# EAGLE design schema (EAGLE 6.3)
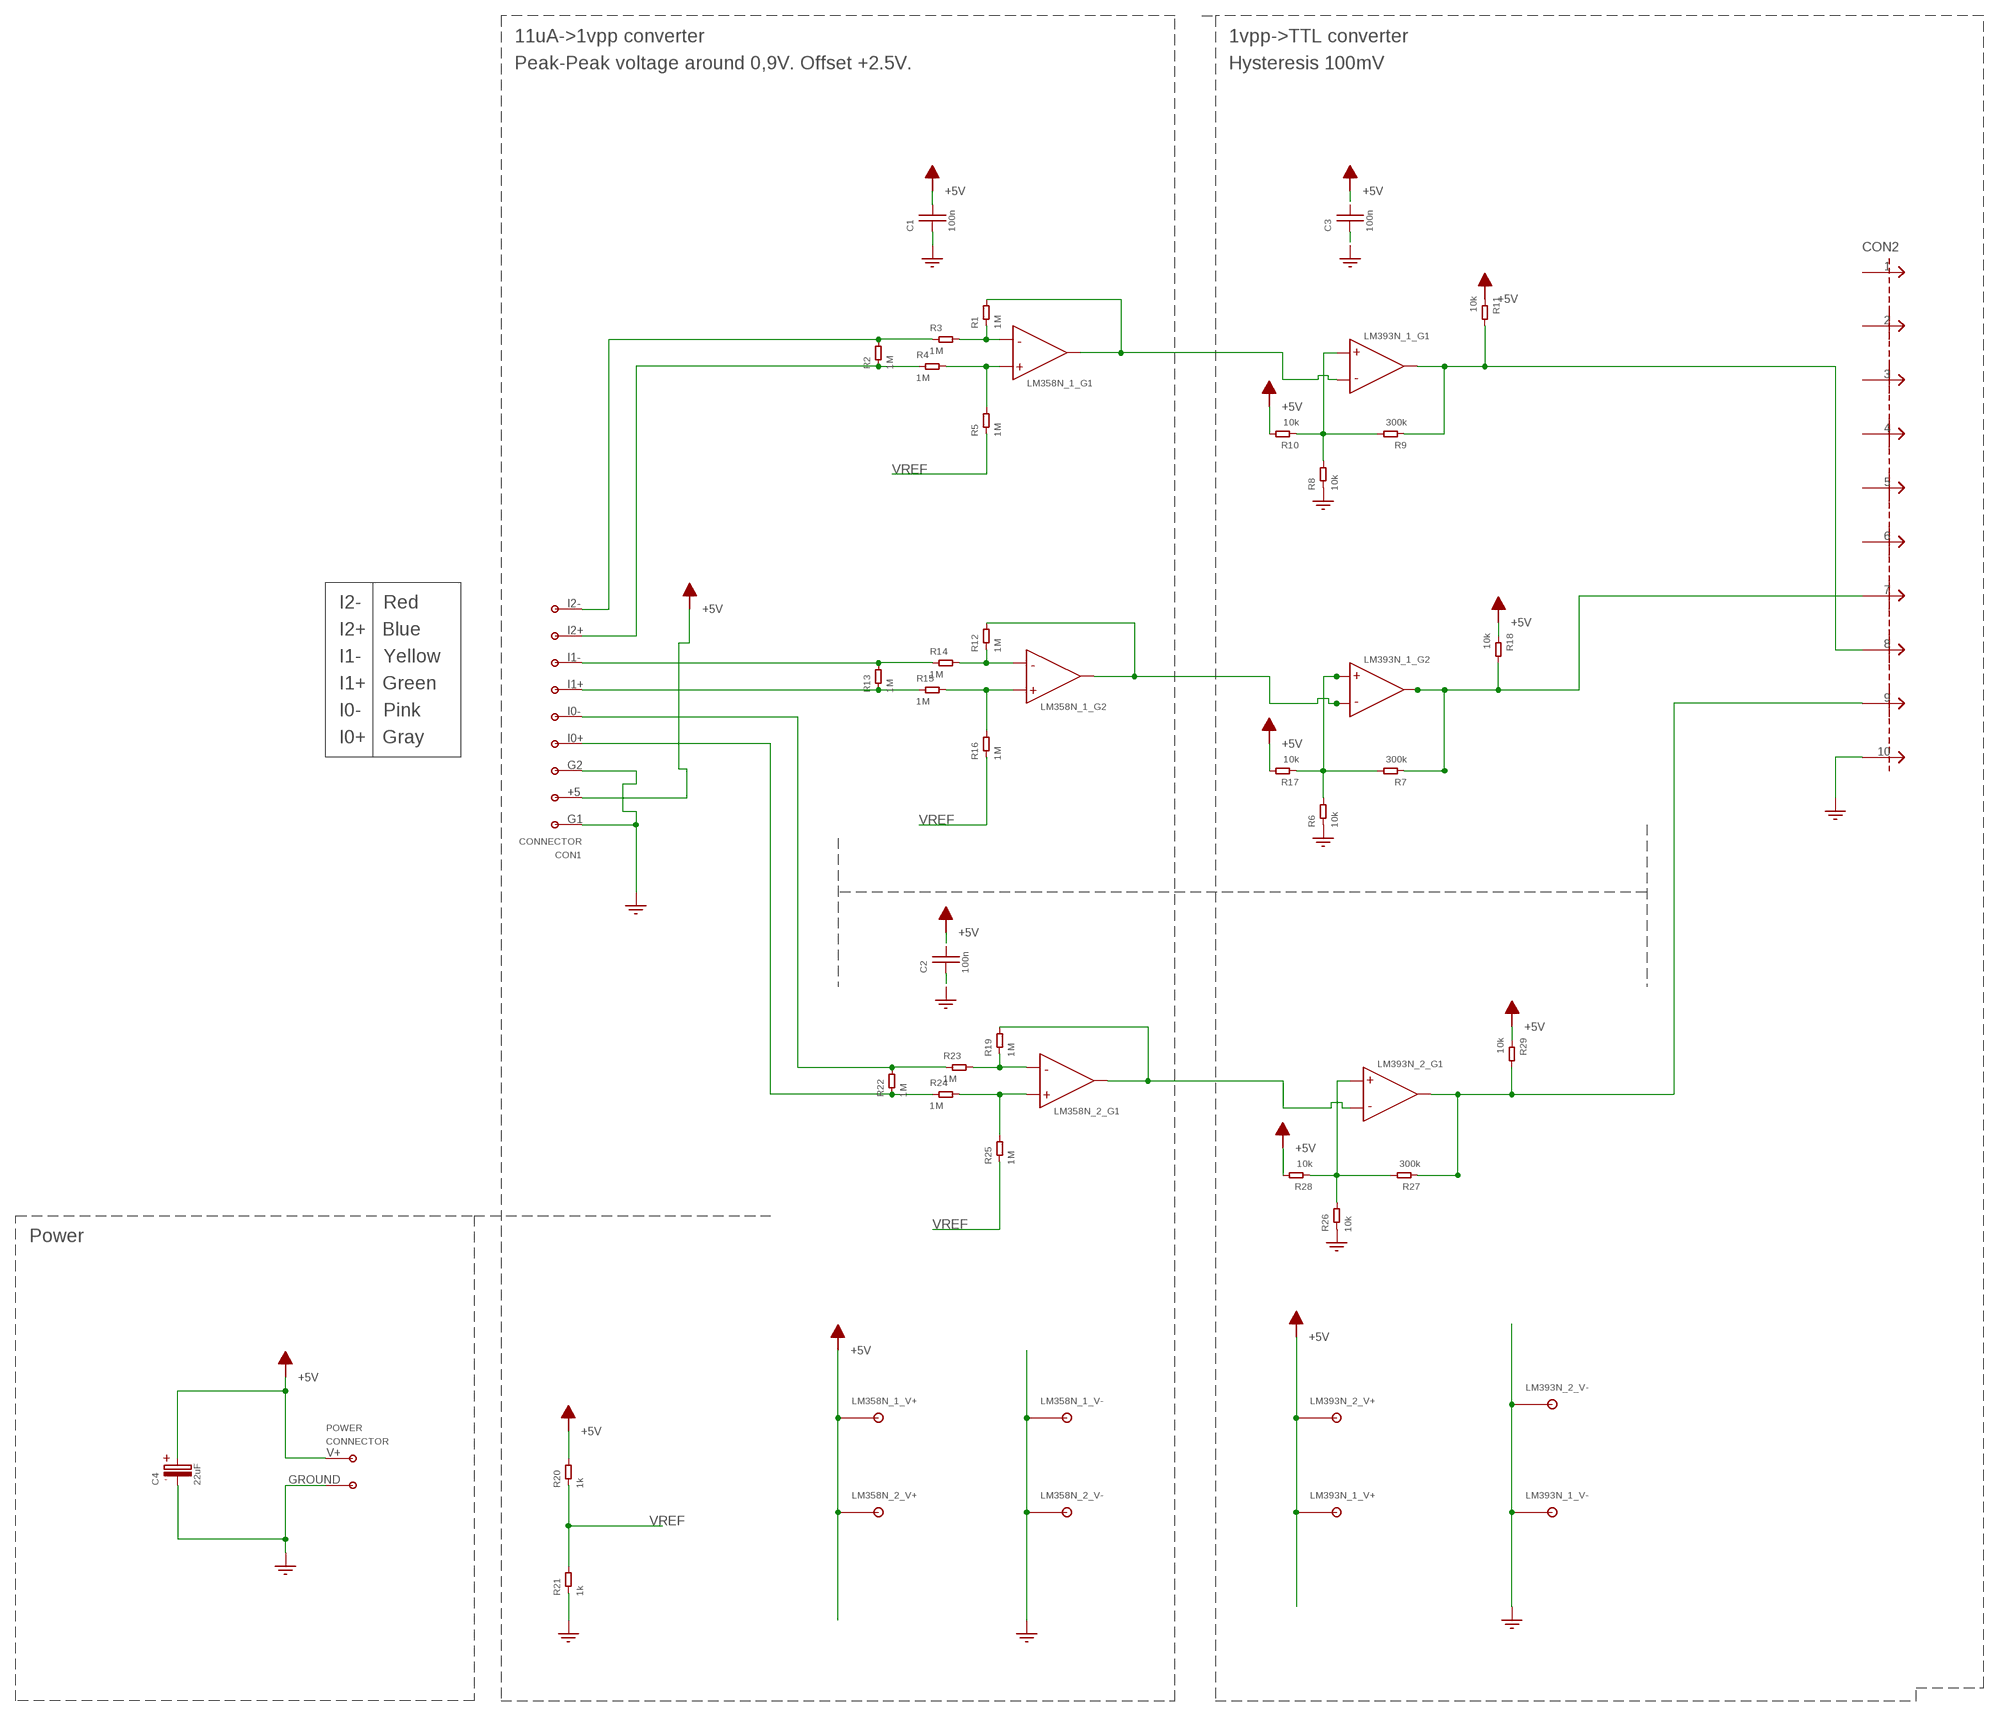
[diagram p0: schematic, sheet 1]

## Parts
C1  100n  CC1206  [R0805]
C2  100n  CC1206  [R0805]
C3  100n  CC1206  [R0805]
C4  22uF  C_POL  [E2,5-6]
CON1  LS403_INPUT_CONNECTOR  [LS403_INPUT_CONNECTOR]
CON2  CONNECTOR_10PINGENERIC2X5  [2X5_GENERIC]
LM358N_1  LM358DIL8  [DIL08]
LM358N_2  LM358DIL8  [DIL08]
LM393N_1  LM393N  [DIL08]
LM393N_2  LM393N  [DIL08]
POWER  2_PIN_CONNECTOR  [2_PIN_GENERIC_POWER_CONNECTOR]
R1  1M  RR0805  [R0805]
R2  1M  RR0805  [R0805]
R3  1M  RR0805  [R0805]
R4  1M  RR0805  [R0805]
R5  1M  RR0805  [R0805]
R6  10k  RR0805  [R0805]
R7  300k  RR0805  [R0805]
R8  10k  RR0805  [R0805]
R9  300k  RR0805  [R0805]
R10  10k  RR0805  [R0805]
R11  10k  RR0805  [R0805]
R12  1M  RR0805  [R0805]
R13  1M  RR0805  [R0805]
R14  1M  RR0805  [R0805]
R15  1M  RR0805  [R0805]
R16  1M  RR0805  [R0805]
R17  10k  RR0805  [R0805]
R18  10k  RR0805  [R0805]
R19  1M  RR0805  [R0805]
R20  1k  RR0805  [R0805]
R21  1k  RR0805  [R0805]
R22  1M  RR0805  [R0805]
R23  1M  RR0805  [R0805]
R24  1M  RR0805  [R0805]
R25  1M  RR0805  [R0805]
R26  10k  RR0805  [R0805]
R27  300k  RR0805  [R0805]
R28  10k  RR0805  [R0805]
R29  10k  RR0805  [R0805]

## Nets
+5V: C1.1 C2.1 C3.1 C4.+ CON1.+5 LM358N_1.8(_V+:SUPPLYPIN) LM358N_2.8(_V+:SUPPLYPIN) LM393N_1.8(_V+:SUPPLYPIN) LM393N_2.8(_V+:SUPPLYPIN) POWER.V+ R10.2 R11.1 R17.2 R18.1 R20.2 R28.2 R29.1
GND: C1.2 C2.2 C3.2 C4.- CON1.G1 CON1.G2 CON2.10 LM358N_1.4(_V-:SUPPLYPIN) LM358N_2.4(_V-:SUPPLYPIN) LM393N_1.4(_V-:SUPPLYPIN) LM393N_2.4(_V-:SUPPLYPIN) POWER.GROUND R6.1 R8.1 R21.1 R26.1
I0_OUT: CON2.9 LM393N_2.1(_G1:OUT) R27.1 R29.2
I1_OUT: CON2.7 LM393N_1.7(_G2:OUT) R7.1 R18.2
I2_OUT: CON2.8 LM393N_1.1(_G1:OUT) R9.1 R11.2
N$1: LM393N_1.5(_G2:+) R6.2 R7.2 R17.1
N$2: LM358N_1.2(_G1:-) R1.1 R3.2
N$3: LM358N_1.1(_G1:OUT) LM393N_1.2(_G1:-) R1.2
N$4: CON1.I2- R2.2 R3.1
N$5: CON1.I2+ R2.1 R4.1
N$6: LM358N_1.3(_G1:+) R4.2 R5.2
N$7: LM393N_1.3(_G1:+) R8.2 R9.2 R10.1
N$8: LM358N_1.6(_G2:-) R12.1 R14.2
N$10: LM358N_1.7(_G2:OUT) LM393N_1.6(_G2:-) R12.2
N$11: CON1.I1- R13.2 R14.1
N$12: CON1.I1+ R13.1 R15.1
N$13: LM358N_1.5(_G2:+) R15.2 R16.2
N$14: LM358N_2.2(_G1:-) R19.1 R23.2
N$15: LM358N_2.1(_G1:OUT) LM393N_2.2(_G1:-) R19.2
N$17: CON1.I0- R22.2 R23.1
N$18: CON1.I0+ R22.1 R24.1
N$19: LM358N_2.3(_G1:+) R24.2 R25.2
N$20: LM393N_2.3(_G1:+) R26.2 R27.2 R28.1
VREF: R5.1 R16.1 R20.1 R21.2 R25.1
Unconnected: CON2.1 CON2.2 CON2.3 CON2.4 CON2.5 CON2.6 LM358N_2.5(_G2:+) LM358N_2.6(_G2:-) LM358N_2.7(_G2:OUT) LM393N_2.5(_G2:+) LM393N_2.6(_G2:-) LM393N_2.7(_G2:OUT)

## Notes on the sheet
- 11uA->1vpp converter | 1vpp->TTL converter
- Peak-Peak voltage around 0,9V. Offset +2.5V. | Hysteresis 100mV
- I2-    Red
- I2+   Blue
- I1-    Yellow
- I1+   Green
- I0-    Pink
- I0+   Gray
- Power

## Library data of the parts
C1-C3 = library:C
C4 = library:C_POL
CON1 = library:LS403_INPUT_CONNECTOR
CON2 = connectors:CONNECTOR_10PIN; PIN10: GND; PIN7: QA; PIN8: QB; PIN9: QIDX
LM358N_1 LM358N_2 = library:LM358
LM393N_1 LM393N_2 = library:LM393N
POWER = library:2_PIN_CONNECTOR
R1-R29 = library:R

## Board
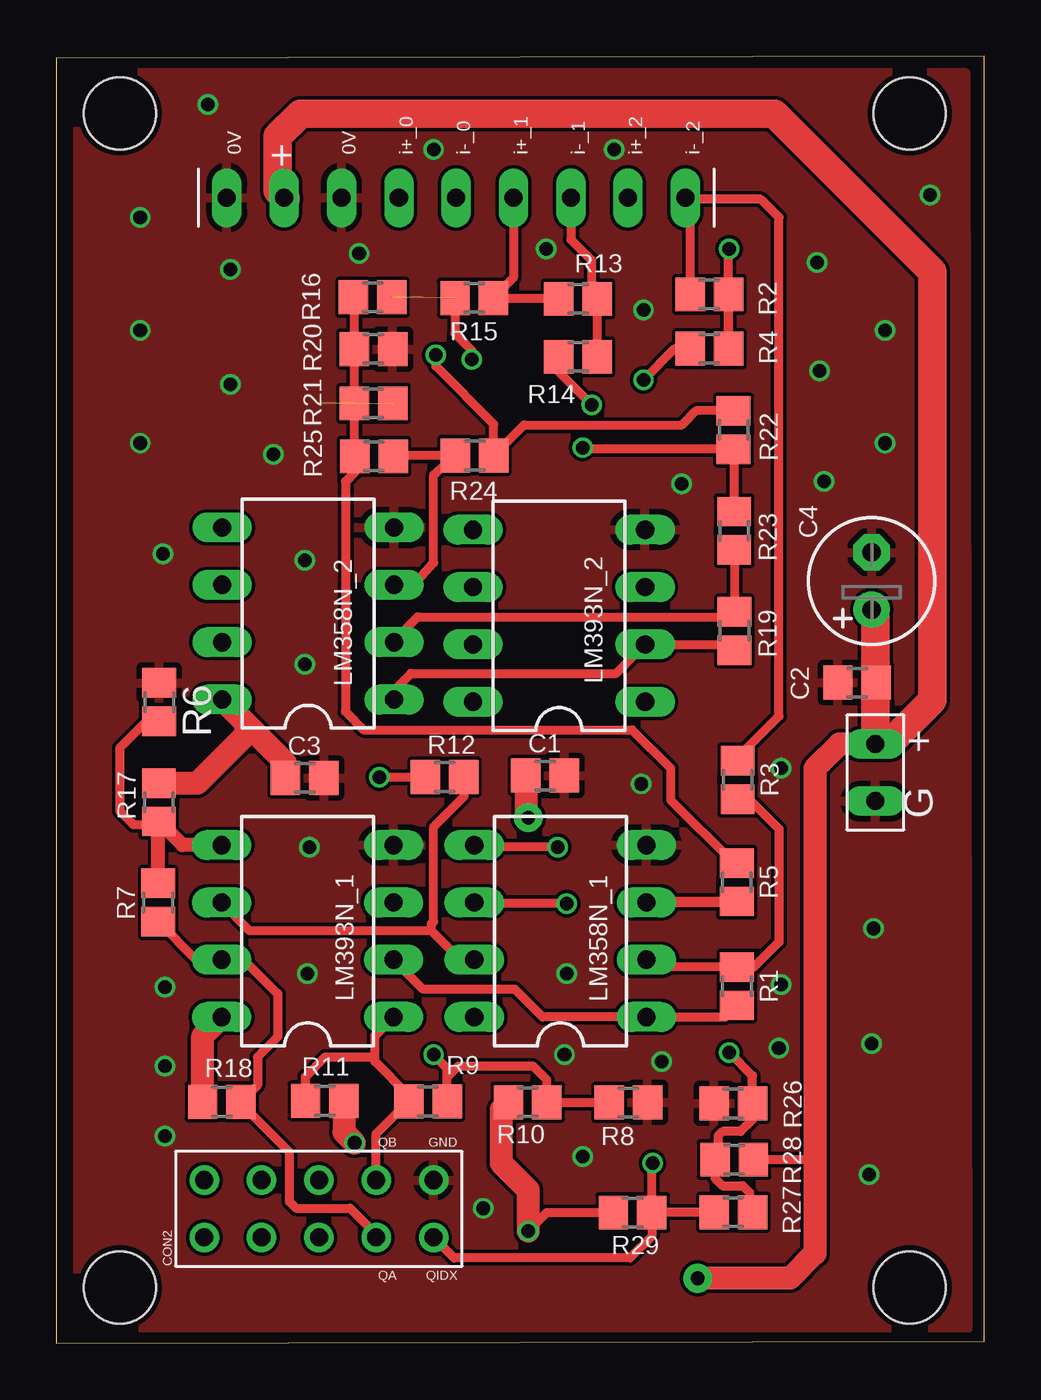
[diagram p1: board, top side]
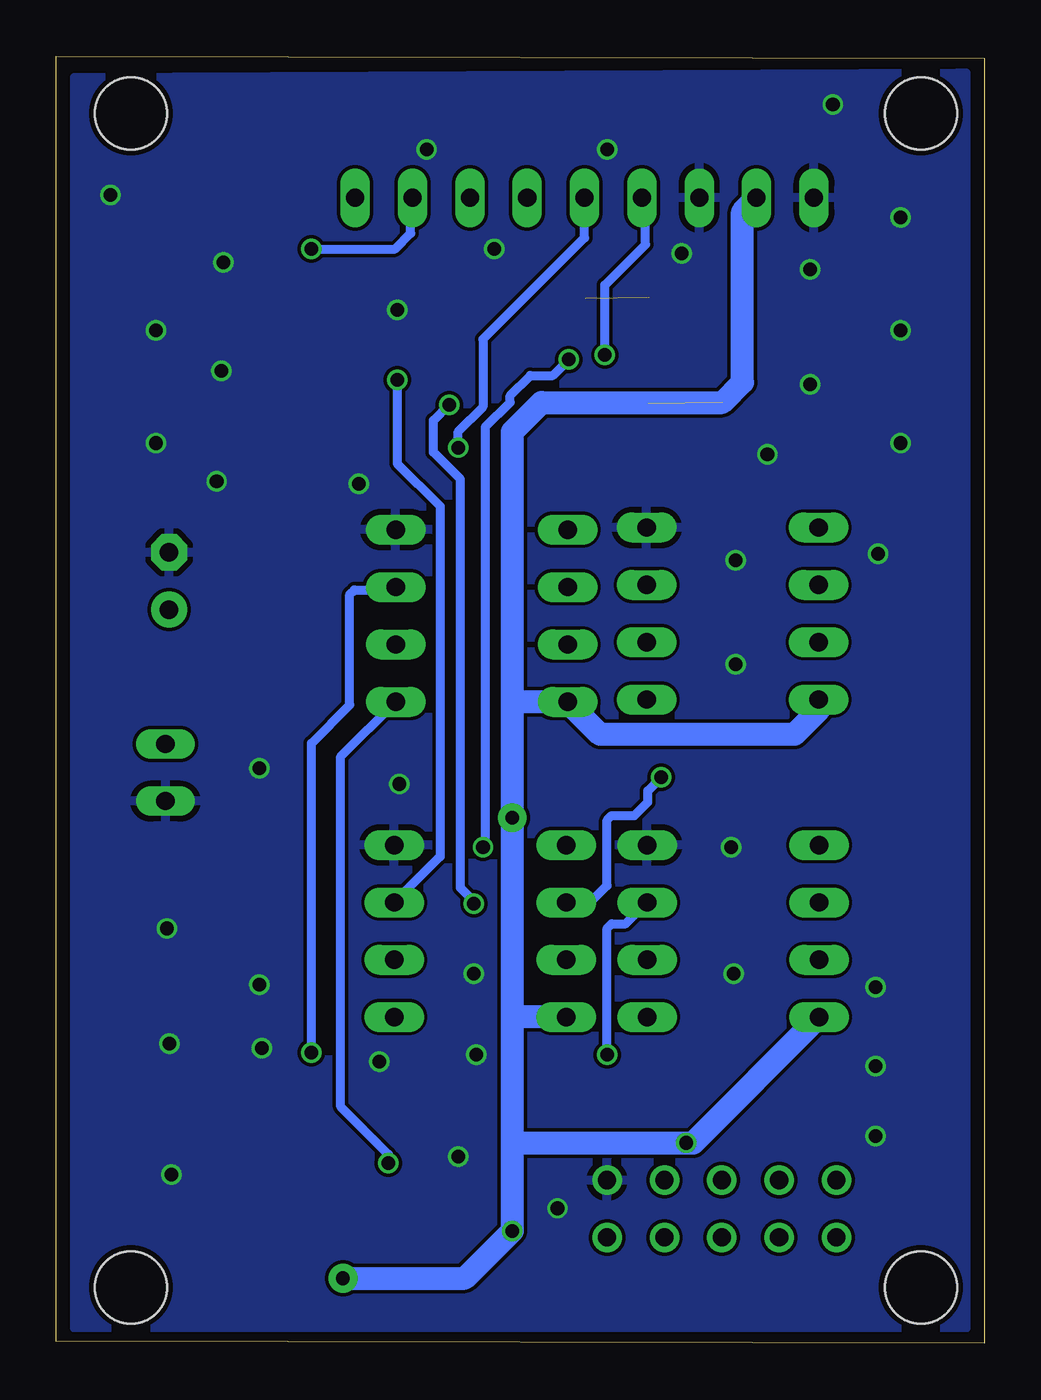
[diagram p2: board, bottom side, seen from below]

Size 41.11 x 57 mm. Coordinates in mm from the lower left corner, seen from the top.
Outline: 0,0 41.11,0.07 41.11,57 0,56.93 0,0
Copper layers (1*16): Top 0.035mm / dielectric 1.5mm / Bottom 0.035mm
Design rules "ITead_rule": minimum track width 6mil, minimum drill 12mil, track to track 6mil, track to pad 6mil, pad to pad 6mil, via to via 6mil, smd to smd 0mil, copper to edge 10mil, drill to drill 10mil, minimum pad ring 10mil, minimum via ring 6mil, stop-mask expansion 2mil, vias tented up to drill 100mil, thermal gap 10mil
Holes 3.2 mm at 2.81,54.47 37.81,54.47 37.81,54.47 37.81,2.47 37.81,2.47 2.81,2.47

### Footprints (pad centres in the part's own frame; a part is rotated, then mirrored left to right if it is on the bottom)
R0805 = smd 1.3 x 1.5: 1 -0.85,0; 2 0.85,0
E2,5-6 = drill 0.813 pad 1.6: + -1.27,0 | drill 0.813 pad 1.6 octagon: - 1.27,0
LS403_INPUT_CONNECTOR = drill 0.8 long: +5 1.27,0; G1 -1.27,0; G2 3.81,0; I0+ 6.35,0; I0- 8.89,0; I1+ 11.43,0; I1- 13.97,0; I2+ 16.51,0; I2- 19.05,0
2X5_GENERIC = drill 0.8: 1 -1.27,0; 2 1.27,0; 3 -1.27,-2.54; 4 1.27,-2.54; 5 -1.27,-5.08; 6 1.27,-5.08; 7 -1.27,-7.62; 8 1.27,-7.62; 9 -1.27,-10.16; 10 1.27,-10.16
DIL08 = drill 0.813 long: 1 -3.81,-3.81; 2 -1.27,-3.81; 3 1.27,-3.81; 4 3.81,-3.81; 5 3.81,3.81; 6 1.27,3.81; 7 -1.27,3.81; 8 -3.81,3.81
2_PIN_GENERIC_POWER_CONNECTOR = drill 0.8 long: GROUND 2.54,0; V+ 0,0

### Placement (x,y rotation side)
C1  21.65,25.14 0 top
C2  35.47,29.26 180 top
C3  11,25.04 0 top
C4  36.12,33.76 90 top
CON1  8.82,50.74 0 top
CON2  6.55,5.95 90 top
LM358N_1  22.33,18.25 90 top
LM358N_2  11.15,32.32 90 top
LM393N_1  11.13,18.25 90 top
LM393N_2  22.27,32.22 90 top
POWER  36.28,26.55 270 top
R1  30.15,15.81 270 top
R2  28.93,46.46 180 top
R3  30.18,24.95 270 top
R4  28.93,44.05 180 top
R5  30.14,20.41 270 top
R6  4.56,28.4 270 top
R7  4.51,19.52 90 top
R8  25.34,10.66 180 top
R9  16.46,10.71 0 top
R10  20.88,10.67 180 top
R11  11.89,10.73 180 top
R12  17.2,25.08 0 top
R13  23.11,46.26 0 top
R14  23.11,43.69 180 top
R15  18.51,46.3 180 top
R16  14.01,46.33 0 top
R17  4.54,23.96 90 top
R18  7.33,10.69 0 top
R19  30.04,31.55 270 top
R20  14.05,41.63 0 top
R21  14.05,44.04 180 top
R22  30,40.45 270 top
R23  30.03,35.99 270 top
R24  18.52,39.32 180 top
R25  14.07,39.28 0 top
R26  29.99,10.62 0 top
R27  29.99,5.8 0 top
R28  30.03,8.13 0 top
R29  25.53,5.78 0 top

### Tracks (layer width: path | path; a pad name or v marks a point on that pad's centre or on a via)
+5V  (via drill 0.6, 0.6 pad 1.27)  (1 unrouted)
  Top 0.406: R29.1 21.72,5.78 v20.91,4.97 | R28.2 33.57,8.13 33.61,8.17
  Top 1.016: POWER.V+ 34.69,26.55 33.61,25.47 33.61,8.17 33.61,3.97 32.51,2.87 v28.41,2.87 | v20.91,4.97 20.91,6.77 19.71,7.97 19.71,10.35 R10.2 | R18.1 6.48,13.6 LM393N_1.8 | R11.1 12.74,9.34 v13.21,8.87 | C1.1 20.8,23.38 v20.91,23.27 | C3.1 10.15,25.7 8.45,27.4 | 8.45,27.4 LM358N_2.8 | R17.2 6.25,24.81 8.41,26.97 8.41,27.37 8.45,27.4
  Top 1.27: POWER.V+ 36.28,29.22 C2.1 | POWER.V+ 36.28,32.33 C4.+ | POWER.V+ 36.89,26.55 38.81,28.47 38.81,47.47 31.81,54.47 10.81,54.47 9.81,53.47 9.81,51.05 10.15,50.71 10.15,50.67
  Bottom 1.016: v28.41,2.87 23.01,2.87 v20.91,4.97 20.91,8.87 | 20.91,8.87 20.91,14.27 | 20.91,14.27 v20.91,23.27 20.91,28.27 | 20.91,28.27 20.91,40.37 19.61,41.67 11.61,41.67 10.71,42.57 10.71,50.12 CON1.+5 | LM358N_1.8 20.74,14.44 20.91,14.27 | 20.91,8.87 v13.21,8.87 12.89,8.87 LM393N_1.8 | 20.91,28.27 20.77,28.41 LM393N_2.8 17.02,26.97 8.41,26.97 7.34,28.04 LM358N_2.8
GND  (via drill 0.6)
  other vias: 22.61,16.37 25.91,24.77 11.21,21.97 11.11,16.37 23.31,8.27 18.91,5.97 26.81,12.47 22.51,12.77 4.81,15.77 4.81,12.27 11.01,30.07 11.01,34.67 27.71,38.07 26.01,45.77 13.41,48.27 21.71,48.47 7.71,47.57 7.71,42.47 9.61,39.37 4.71,34.97 4.81,9.17 32.01,13.07 32.11,15.87 32.11,25.47 34.01,38.17 33.81,43.07 33.71,47.87 36.21,18.37 36.11,13.27 36.01,7.47 36.71,44.87 36.71,39.87 38.71,50.87 16.71,52.87 24.71,52.87 6.71,54.87 3.71,49.87 3.71,44.87 3.71,39.87
  pour Bottom: 0.81,56.27 0.81,0.67 40.31,0.67 40.31,56.07 1.21,56.27
  pour Top: 0.91,56.27 0.91,0.67 40.41,0.67 40.41,0.87 40.31,56.07 40.31,56.27
I0_OUT  (via drill 0.6)
  Top 0.406: R27.1 26.4,5.8 R29.2 | R29.2 26.38,4.74 25.41,3.77 17.62,3.77 CON2.9 | R29.2 26.38,7.94 v26.41,7.97
  Bottom 0.406: v26.41,7.97 26.41,8.37 28.51,10.47 28.51,25.98 LM393N_2.1
I1_OUT
  Top 0.406: R7.1 6.2,16.98 LM393N_1.7 8.3,16.98 9.81,15.47 9.81,13.57 8.91,12.67 8.91,11.42 R18.2 8.18,10.6 10.31,8.47 10.31,6.27 10.61,5.97 13.01,5.97 14.17,4.81 CON2.7
I2_OUT
  Top 0.406: CON2.8 14.17,9.27 R9.1 15.61,10.97 14.11,12.47 14.11,12.67 | 14.11,12.67 14.11,13.61 LM393N_1.1 | R11.2 11.04,11.8 11.91,12.67 14.11,12.67
N$1
  Top 0.406: 4.29,27.55 3.99,27.55 2.81,26.37 2.81,23.57 3.41,22.97 4.4,22.97 R17.1
  Top 0.61: LM393N_1.5 5.59,22.06 R17.1 | R7.2 4.51,23.08 R17.1 | R6.2 4.29,27.55 | 4.5,23.07 R17.1
N$2
  Top 0.406: R3.2 30.68,24.1 32.01,22.77 32.01,17.77 30.9,16.66 R1.1 26.46,16.66 LM358N_1.2
N$3
  Top 0.406: R1.2 29.63,14.44 LM358N_1.1 21.54,14.44 20.31,15.67 16.25,15.67 LM393N_1.2
N$4
  Top 0.406: R2.2 28.08,50.53 CON1.I2- 27.94,50.67 31.21,50.67 32.01,49.87 32.01,27.77 30.18,25.94 R3.1
N$5  (via drill 0.6)
  Top 0.406: R2.1 R4.1 29.78,48.44 v29.81,48.47
  Bottom 0.406: v29.81,48.47 26.11,48.47 25.41,49.17 25.41,50.66 CON1.I2+
N$6  (via drill 0.6)
  Top 0.406: LM358N_1.3 30.1,19.52 R5.2 26.4,19.56 26.31,19.47 | R4.2 27.39,44.05 v26.01,42.67
  Bottom 0.406: v26.01,42.67 26.01,38.97 24.11,37.07 24.11,21.55 LM358N_1.3
N$7  (via drill 0.6)
  Top 0.406: v16.71,12.77 17.31,12.17 R9.2 17.31,11.77 17.81,12.27 21.11,12.27 21.73,11.65 R10.1 R8.2
  Bottom 0.406: v16.71,12.77 16.71,18.37 16.51,18.57 15.89,18.57 LM393N_1.3
N$8  (via drill 0.6)
  Top 0.406: v14.31,25.07 R12.1 | R14.2 22.26,43.02 v23.71,41.57 | v22.61,19.47 18.57,19.47 LM358N_1.6
  Bottom 0.406: LM358N_1.6 17.46,19.52 16.71,20.27 16.71,23.17 16.51,23.37 15.51,23.37 14.91,23.97 14.91,24.47 v14.31,25.07 | v22.61,19.47 22.61,19.57 23.21,20.17 23.21,38.27 24.41,39.47 24.41,40.87 v23.71,41.57
N$10
  Top 0.406: LM358N_1.7 17.9,16.98 16.61,18.27 | 16.61,18.27 8.57,18.27 LM393N_1.6 | 16.61,18.27 16.61,18.57 16.71,18.67 16.71,22.87 18.05,24.21 R12.2
N$11
  Top 0.406: CON1.I1- 22.79,48.89 23.71,47.97 23.71,46.51 R13.2 R14.1
N$12
  Top 0.406: CON1.I1+ 20.25,47.19 R15.1 19.4,46.26 R13.1
N$13  (via drill 0.6)  (1 unrouted)
  Top 0.406: R15.2 17.66,44.72 18.41,43.97 v18.41,43.57 | v22.21,21.97 18.61,21.97 LM358N_1.5
  Bottom 0.406: v22.21,21.97 22.11,22.07 22.11,40.57 21.01,41.67 21.01,41.97 20.11,42.87 19.11,42.87 v18.41,43.57
N$14
  Top 0.406: R23.2 R19.1 29.81,32.17 16.01,32.17 14.96,31.12 LM358N_2.2
N$15
  Top 0.406: LM358N_2.1 14.96,28.92 15.71,29.67 24.8,29.67 LM393N_2.2 29.79,30.95 R19.2
N$17  (via drill 0.6)
  Top 0.406: R23.1 30.03,39.57 R22.2 23.38,39.6 v23.31,39.67
  Bottom 0.406: CON1.I0- 17.71,48.97 22.21,44.47 22.21,41.47 23.31,40.37 v23.31,39.67
N$18  (via drill 0.6)
  Top 0.406: v16.81,43.77 16.81,43.27 19.38,40.7 R24.1 20.72,40.67 27.71,40.67 28.34,41.3 R22.1
  Bottom 0.406: v16.81,43.77 16.81,46.87 15.01,48.67 15.01,50.58 CON1.I0+
N$19
  Top 0.406: R25.2 14.96,39.32 R24.2 16.71,38.45 16.71,34.57 15.83,33.59 LM358N_2.3
N$20  (via drill 0.6)
  Top 0.406: v29.81,12.87 30.84,11.84 R26.2 30.84,9.9 30.31,9.37 29.51,9.37 29.31,9.17 29.31,8.26 R28.1 29.18,7.3 29.51,6.97 30.41,6.97 30.71,6.67 30.71,5.93 R27.2
  Bottom 0.406: v29.81,12.87 29.81,26.57 28.11,28.27 28.11,33.17 27.91,33.37 26.2,33.37 LM393N_2.3
VREF
  Top 0.406: R16.1 13.2,46.29 R21.2 R20.1 13.22,41.61 R25.1 13.22,38.58 12.81,38.17 12.81,27.97 13.61,27.17 25.51,27.17 27.21,25.47 27.21,24.07 30.02,21.26 R5.1